# Altium project l2-l3.PrjPcb
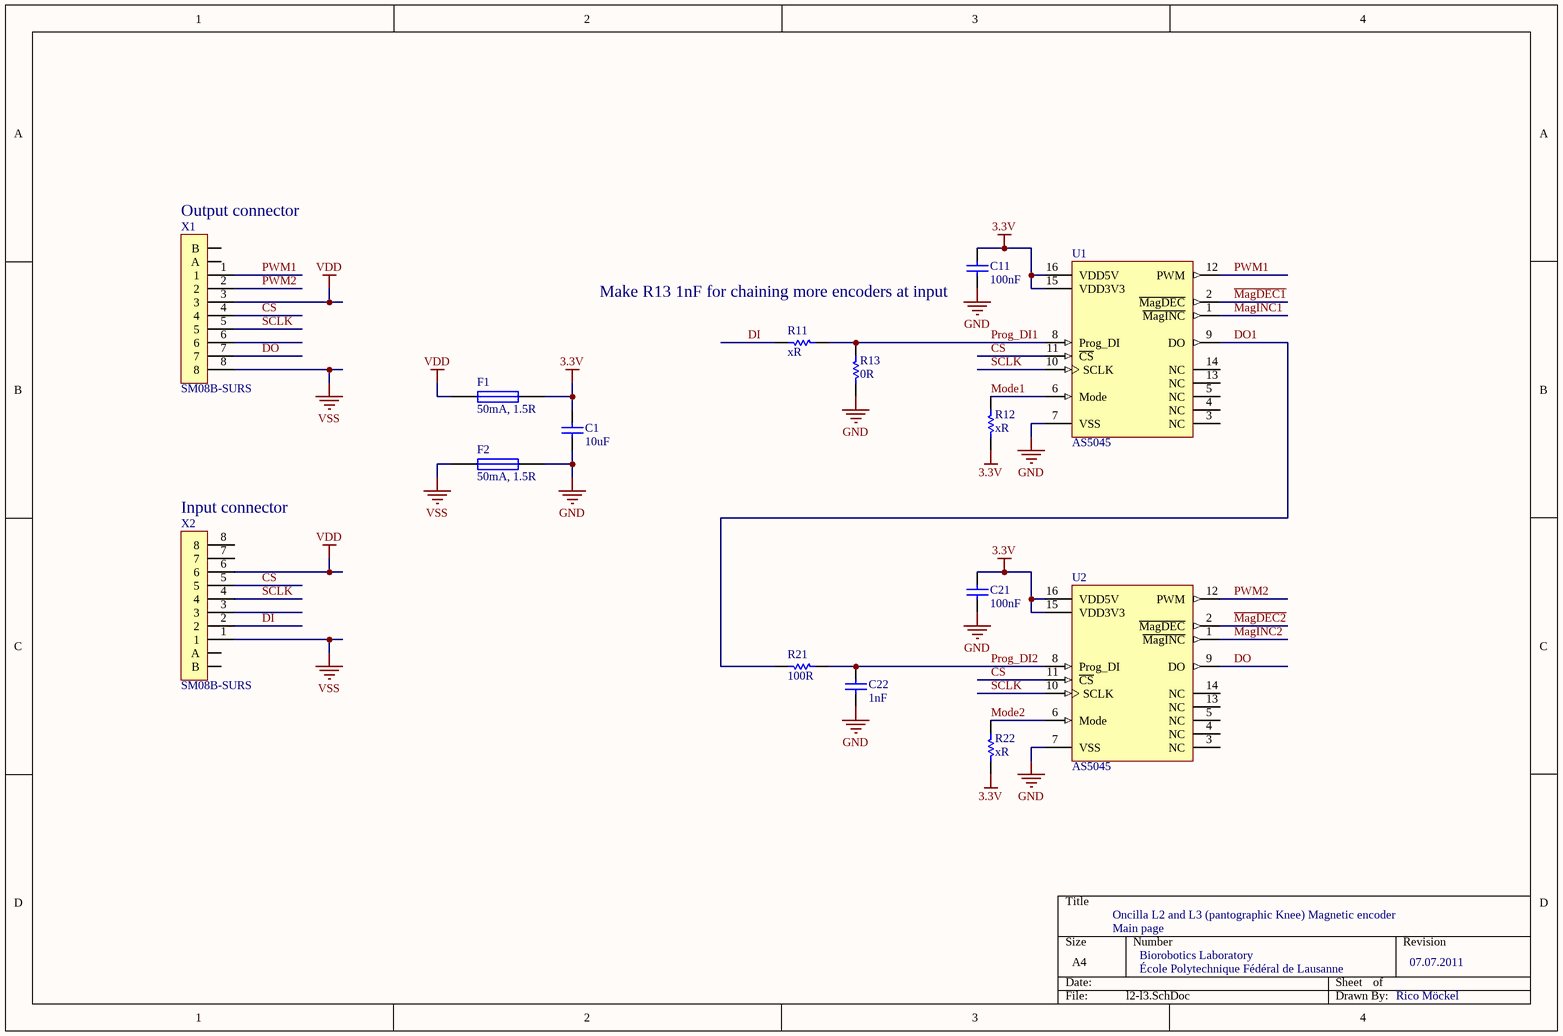
[diagram p0: l2-l3.SchDoc]
1 sheet, 15 parts. Net scope: global (net labels, ports and power ports of the same name join across sheets).
Board files: l2-l3-front.PcbDoc, l2-l3-hind.PcbDoc

## Sheet l2-l3.SchDoc
size A4

### Parts
C1  10uF  [CAPC1608N]
C11  100nF  [CAPC1005N]
C21  100nF  [CAPC1005N]
C22  1nF  [CAPC1005N]
F1  50mA, 1.5R  [RESC1608N]
F2  50mA, 1.5R  [RESC1608N]
R11  xR  [RESC1005N]
R12  xR  [RESC1005N]
R13  0R  [RESC1005N]
R21  100R  [RESC1005N]
R22  xR  [RESC1005N]
U1  AS5045  [SSOP16]
U2  AS5045  [SSOP16]
X1  SM08B-SURS  [SM08B-SURS]
X2  SM08B-SURS  [SM08B-SURS]

### Nets
3.3V: C1.2 C11.1 C21.1 F1.2 R12.1 R22.1 U1.15(VDD3V3) U1.16(VDD5V) U2.15(VDD3V3) U2.16(VDD5V)
GND: C1.1 C11.2 C21.2 C22.2 F2.2 R13.1 U1.7(VSS) U2.7(VSS)
VDD: F1.1 X1.3 X2.6
VSS: F2.1 X1.8 X2.1
~{CS}: U1.11(~{CS}) U2.11(~{CS}) X1.4 X2.5
DI: R11.1 X2.2
DO: U2.9(DO) X1.7
DO1: R21.1 U1.9(DO)
~{MagDEC1}: U1.2(~{MagDEC})
~{MagDEC2}: U2.2(~{MagDEC})
~{MagINC1}: U1.1(~{MagINC})
~{MagINC2}: U2.1(~{MagINC})
Mode1: R12.2 U1.6(Mode)
Mode2: R22.2 U2.6(Mode)
Prog_DI1: R11.2 R13.2 U1.8(Prog_DI)
Prog_DI2: C22.1 R21.2 U2.8(Prog_DI)
PWM1: U1.12(PWM) X1.1
PWM2: U2.12(PWM) X1.2
SCLK: U1.10(SCLK) U2.10(SCLK) X1.5 X2.4

Not connected (* = marked no-connect by the designer): U1 3(NC) 4(NC) 5(NC) 13(NC) 14(NC); U2 3(NC) 4(NC) 5(NC) 13(NC) 14(NC); X1 6 A B; X2 3 7 8 A B

### Notes on the sheet
- (near X1) Output connector
- (near C11) Make R13 1nF for chaining more encoders at input
- (near X2) Input connector
- Oncilla L2 and L3 (pantographic Knee) Magnetic encoder
- Main page
- École Polytechnique Fédéral de Lausanne
- Biorobotics Laboratory
- 07.07.2011
- Rico Möckel

### Library data of the parts
C1 C11 C21 C22 = Cap: Capacitor; Published: 8-Jun-2000; LatestRevisionDate: 17-Jul-2002; LatestRevisionNote: Re-released for DXP Platform.; PackageReference: 0603; Publisher: Altium Limited
F1 F2 = Fuse 1: Ferrit Bead; Published: 8-Jun-2000; LatestRevisionDate: 17-Jul-2002; LatestRevisionNote: Re-released for DXP Platform.; PackageReference: PIN-W2/E2.8; Publisher: Altium Limited
R11-R13 R21 R22 = Res1: Resistor; Published: 8-Jun-2000; LatestRevisionDate: 17-Jul-2002; LatestRevisionNote: Re-released for DXP Platform.; PackageReference: AXIAL-0.3; Publisher: Altium Limited
U1 U2 = AS5045: 12 Bit Programmable Magnetic Rotary Encoder
X1 X2 = SM08B-SURS: wire-to-board connector